# Altium schematic sheet USB-UART.SchDoc
size Letter; Organization: Cegep Limoilou; Address1: 1300, 8e Avenue; Address2: Québec, QC; Address3: Canada; Address4: G1J 5L5; Revision: Enseignants; SheetNumber: 8; SheetTotal: 8; Conception: Ilyes Gharmoul; Titre: USB-UART; Modification: Ilyes G
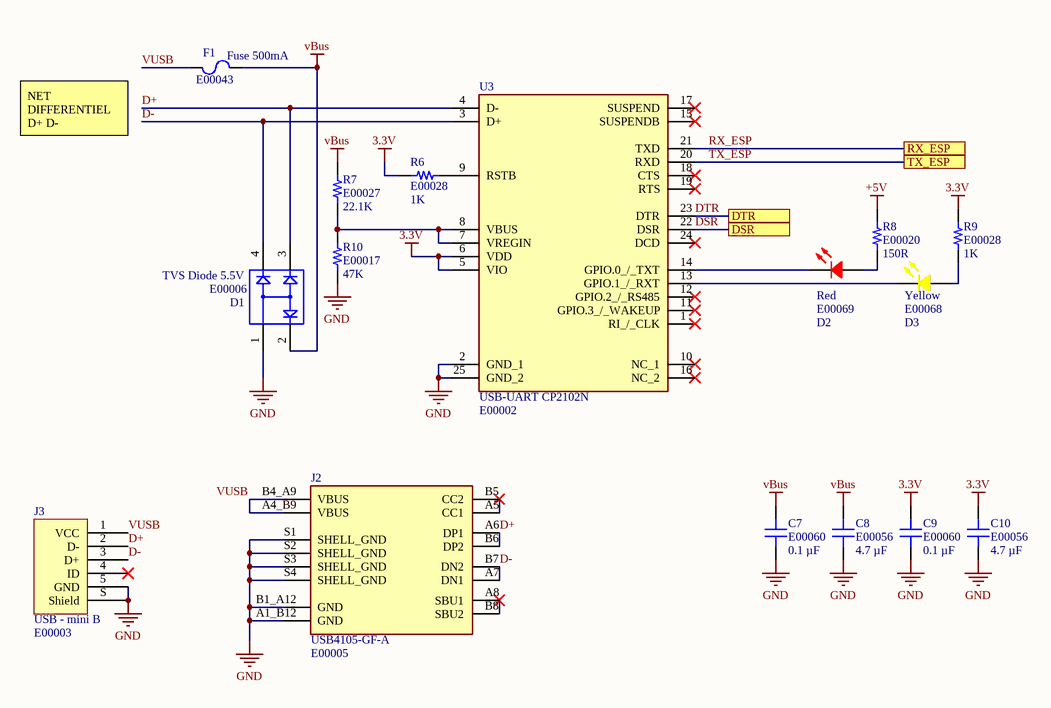
[diagram p0: USB-UART.SchDoc]

## Parts
C7  ADAM Inventory Number 1: E00060  [CAP 0603]  (hidden comment: 0.1 µF)
C8  ADAM Inventory Number 1: E00056  [CAP 0603]  (hidden comment: 4.7 µF)
C9  ADAM Inventory Number 1: E00060  [CAP 0603]  (hidden comment: 0.1 µF)
C10  ADAM Inventory Number 1: E00056  [CAP 0603]  (hidden comment: 4.7 µF)
D1  TVS Diode 5.5V  ADAM Inventory Number 1: E00006  [TVS 5.5 DIODE]
D2  Red  ADAM Inventory Number 1: E00069  [Red Led 0603]
D3  Yellow  ADAM Inventory Number 1: E00068  [YELLOW LED 0603 - duplicate]
F1  Fuse 500mA  ADAM Inventory Number 1: E00043  [Fuse 500mA 0.6mm]
J2  USB4105-GF-A  ADAM Inventory Number 1: E00005  [USB C HORIZONTAL]
J3  USB - mini B  ADAM Inventory Number 1: E00003  [USB B Horizontal]
R6  ADAM Inventory Number 1: E00028  [RES 0603]  (hidden comment: 1K)
R7  ADAM Inventory Number 1: E00027  [RES 0603]  (hidden comment: 22.1K)
R8  ADAM Inventory Number 1: E00020  [RES 0603]  (hidden comment: 150R)
R9  ADAM Inventory Number 1: E00028  [RES 0603]  (hidden comment: 1K)
R10  ADAM Inventory Number 1: E00017  [RES 0603]  (hidden comment: 47K)
U3  USB-UART CP2102N  ADAM Inventory Number 1: E00002  [CP2102N-USB-UART]

## Ports
DSR, DTR, RX_ESP, TX_ESP

## Nets
3.3V: C9.2 C10.2 R6.2 R9.2 U3.5(VIO) U3.6(VDD)
+5V: R8.2
GND: C7.1 C8.1 C9.1 C10.1 D1.1 J2.A1_B12(GND) J2.B1_A12(GND) J2.S1(SHELL_GND) J2.S2(SHELL_GND) J2.S3(SHELL_GND) J2.S4(SHELL_GND) J3.5(GND) J3.S(Shield) R10.1 U3.2(GND_1) U3.25(GND_2)
vBus: C7.2 C8.2 D1.2 F1.2 R7.2
D+: D1.3 J2.A6(DP1) J2.B6(DP2) J3.2(D-) U3.4(D-)
D-: D1.4 J2.A7(DN1) J2.B7(DN2) J3.3(D+) U3.3(D+)
DSR: U3.22(DSR) ; port DSR
DTR: U3.23(DTR) ; port DTR
RX_ESP: U3.21(TXD) ; port RX_ESP
TX_ESP: U3.20(RXD) ; port TX_ESP
VUSB: F1.1 J2.A4_B9(VBUS) J2.B4_A9(VBUS) J3.1(VCC)
NetD2_1: D2.1 R8.1
NetD2_2: D2.2 U3.14(GPIO.0_/_TXT)
NetD3_1: D3.1 R9.1
NetD3_2: D3.2 U3.13(GPIO.1_/_RXT)
NetJ2_A5: J2.A5(CC1) J2.B5(CC2)
NetJ2_A8: J2.A8(SBU1) J2.B8(SBU2)
NetR6_1: R6.1 U3.9(RSTB)
NetR7_1: R7.1 R10.2 U3.7(VREGIN) U3.8(VBUS)

Not connected (* = marked no-connect by the designer): J3 4(ID)*; U3 1(RI_/_CLK)* 10(NC_1)* 11(GPIO.3_/_WAKEUP)* 12(GPIO.2_/_RS485)* 15(SUSPENDB)* 16(NC_2)* 17(SUSPEND)* 18(CTS)* 19(RTS)* 24(DCD)*

## Notes on the sheet
- NET DIFFERENTIEL D+ D-
- Titre :
- Conception :
- Date :
- Modification :
- Heure :
- Révision :
- Feuille
- de
- Fichier :

## Library data of the parts
C7 C9 = CAP CER 0.1UF 50V X7R 0603: Manufacturer Part Number 1: C0603C104K5RAC7411; manufacturer: KEMET; Tolerance: ±10%; Applications: Bypass, Decoupling; Capacitance: 0.1 µF; componentlink1description: Datasheet; componentlink1url: https://api.kemet.com/component-edge/download/datasheet/C0603C104K5RAC7411.pdf; componentlink2description: DigiKey Link; componentlink2url: https://www.digikey.com/en/products/detail/kemet/C0603C104K5RAC7411/3317013; Device Package: 0603 (1608 Metric); lastupdated: 2023-03-28 19:09:05; Lifecycle Status: Active; Minimum Order: 1; Mounting Type: Surface Mount, MLCC; Operating Temperature: -55°C ~ 125°C; Package / Case: 0603 (1608 Metric); packaging: TapeAndReel; partid: 2233; Part Status: Active; price: 0.01; series: SMD Comm X7R; Size / Dimension: 0.063" L x 0.031" W (1.60mm x 0.80mm); Supplier 1: DigiKey; Supplier Part Number 1: 399-C0603C104K5RAC7411CT-ND; Temperature Coefficient: X7R; Thickness (Max): 0.035" (0.90mm); Voltage - Rated: 50V; Value: 0.1 µF
C8 C10 = CAP CER 4.7UF 25V X5R 0603: Manufacturer Part Number 1: CL10A475KA8NQNC; manufacturer: Samsung Electro-Mechanics; Tolerance: ±10%; Applications: General Purpose; Capacitance: 4.7 µF; componentlink1description: Datasheet; componentlink1url: http://www.samsungsem.com/kr/support/product-search/mlcc/CL10A475KA8NQNC.jsp; componentlink2description: DigiKey Link; componentlink2url: https://www.digikey.com/en/products/detail/samsung-electro-mechanics/CL10A475KA8NQNC/3887558; Device Package: 0603 (1608 Metric); lastupdated: 2023-03-30 19:09:15; Lifecycle Status: Active; Minimum Order: 1; Mounting Type: Surface Mount, MLCC; Operating Temperature: -55°C ~ 85°C; Package / Case: 0603 (1608 Metric); packaging: TapeAndReel; partid: 2349; Part Status: Active; price: 0.06; series: CL; Size / Dimension: 0.063" L x 0.031" W (1.60mm x 0.80mm); Supplier 1: DigiKey; Supplier Part Number 1: 1276-1900-1-ND; Temperature Coefficient: X5R; Thickness (Max): 0.035" (0.90mm); Voltage - Rated: 25V; Value: 4.7 µF
D1 = TVS Diode 5.5V: 8.5V Clamp Ipp Tvs Diode Surface Mount SOT-143-4; Manufacturer Part Number 1: SP0503BAHTG; Manufacturer: Littelfuse; Component Type: Diodes
D2 = 0603 RED LED: Manufacturer Part Number 1: BL-HUB36A-AV-TRB; Manufacturer: American Bright Optoelectronics Corporation; Configuration: Standard; Current - Test: 20mA; Lens Color: Colorless; Lens Style: Rectangle with Flat Top; Lens Transparency: Clear; Millicandela Rating: 94mcd; Viewing Angle: 120°; Voltage - Forward (Vf) (Typ): 2.2V; Wavelength - Dominant: 632nm; Wavelength - Peak: 645nm; Color: Red; ComponentLink1Description: Datasheet; ComponentLink1URL: https://americanbrightled.com/pdffiles/smt/BL-HUB36A-AV-TRB.pdf; ComponentLink2Description: DigiKey Link; ComponentLink2URL: https://www.digikey.com/en/products/detail/american-bright-optoelectronics-corporation/BL-HUB36A-AV-TRB/9678174; Device Package: 0603 (1608 Metric); Height (Max): 0.70mm; LastUpdated: 2023-03-27 19:53:19; Lifecycle Status: Active; Minimum Order: 1; Mounting Type: Surface Mount; Package / Case: 0603 (1608 Metric); Packaging: TapeAndReel; PartId: 1020; Part Status: Active; Price: 0.04; Series: -; Size / Dimension: 1.60mm L x 0.80mm W; Supplier 1: DigiKey; Supplier Part Number 1: BL-HUB36A-AV-TRBCT-ND; Supplier Device Package: 0603; Value: Red
D3 = 0603 YELLOW LED: 0603 YELLOW; Manufacturer Part Number 1: BL-HKC36D-AV-TRB; Manufacturer: American Bright Optoelectronics Corporation; Configuration: 0603; Current - Test: 20mA; Lens Color: Colorless; Lens Size: 0.87mm x 0.80mm; Lens Style: Rectangle with Flat Top; Lens Transparency: Clear; Millicandela Rating: 120mcd; Viewing Angle: 120°; Voltage - Forward (Vf) (Typ): 2V; Wavelength - Dominant: 589nm; Wavelength - Peak: 590nm; Color: Yellow; ComponentLink1Description: Datasheet; ComponentLink1URL: http://americanbrightled.com/pdffiles/smt/BL-HKC36D-AV-TRB.pdf; ComponentLink2Description: DigiKey Link; ComponentLink2URL: https://www.digikey.com/en/products/detail/american-bright-optoelectronics-corporation/BL-HKC36D-AV-TRB/9678175; Device Package: 0603 (1608 Metric); Height (Max): 0.85mm; LastUpdated: 2023-03-27 19:54:01; Lifecycle Status: Active; Minimum Order: 1; Mounting Type: Surface Mount; Package / Case: 0603 (1608 Metric); Packaging: TapeAndReel; PartId: 82; Part Status: Active; Price: 0.04; Series: -; Size / Dimension: 1.60mm L x 0.80mm W; Supplier 1: DigiKey; Supplier Part Number 1: BL-HKC36D-AV-TRBCT-ND; Supplier Device Package: 0603; Value: Yellow
F1 = Fuse 500mA: FUSE BOARD MNT 500MA 125VAC/VDC; Manufacturer: Schurter Inc.; Manufacturer Part Number 1: 3413.0113.22; Approval Agency: cURus; Breaking Capacity @ Rated Voltage: 50A; Fuse Type: Board Mount (Cartridge Style Excluded); Melting I²t: 0.02; Response Time: Fast Blow; Voltage Rating - AC: 125V; Approvals: cURus; ComponentLink1Description: Datasheet; ComponentLink1URL: http://www.schurterinc.com/bundles/snceschurter/epim/_ProdPool_/newDS/en/typ_USF_1206.pdf; ComponentLink2Description: DigiKey Link; ComponentLink2URL: http://digikey.com/product-detail/en/schurter-inc/3413.0113.22/486-1675-1-ND/2870075; Current Rating (Amps): 500mA; Device Package: 1206 (3216 Metric); LastUpdated: 2020-09-02 01:30:41; Lifecycle Status: Active; Minimum Order: 1; Mounting Type: Surface Mount; Operating Temperature: -55°C ~ 90°C; Package / Case: 1206 (3216 Metric); Packaging: TapeAndReel; Part Status: Active; Price: 0.24; Series: USF 1206; Size / Dimension: 0.126" L x 0.063" W x 0.024" H (3.20mm x 1.60mm x 0.60mm); Supplier 1: DigiKey; Supplier Part Number 1: 486-1675-1-ND; Voltage Rating - DC: 125V
J2 = USB C: USB-C (USB TYPE-C) USB 2.0 Receptacle Connector 24 (16+8 Dummy) Position Surface Mount, Right Angle; Through Hole; Manufacturer Part Number 1: USB4105-GF-A; Supplier 1: Newark; Supplier Part Number 1: 86AH2021
J3 = USB MINI B: CONN RCPT MINI USB B 5POS SMD RA; Manufacturer: Amphenol ICC (FCI); Manufacturer Part Number 1: 10033526-N3212LF; Current Rating (Amps): 1A per Contact; Gender: Receptacle; Mating Cycles: 5000; Number of Contacts: 5; Number of Ports: 1; Shielding: Shielded; Voltage - Rated: 30V; ComponentLink1Description: Datasheet; ComponentLink1URL: http://www.amphenol-icc.com/media/wysiwyg/files/drawing/10033526.pdf; ComponentLink2Description: DigiKey Link; ComponentLink2URL: //digikey.com/product-detail/en/amphenol-icc-fci/10033526-N3212LF/609-4700-2-ND/4292074; Connector Type: USB - mini B; Features: Board Guide, Solder Retention; LastUpdated: 2019-12-09 20:52:14; Lifecycle Status: 0; Minimum Order: 1; Mounting Feature: Horizontal; Mounting Type: Surface Mount, Right Angle; Operating Temperature: -25°C ~ 85°C; Packaging: TapeAndReel; Part Status: Active; Price: 0.39; Series: -; Supplier 1: DigiKey; Supplier Part Number 1: 609-4700-2-ND; Termination: Solder
R6 R9 = RES SMD 1K OHM: RES 1K OHM 1% 1/4W 0603; Manufacturer Part Number 1: SR0603FR-7T1KL; Manufacturer: Yageo; Power (Watts): 0.25W, 1/4W; Temperature Coefficient: ±100ppm/°C; ComponentLink1Description: Datasheet; ComponentLink1URL: http://www.yageo.com/documents/recent/PYu-SR_D_F%20tol_RoHS_L_4.pdf; ComponentLink2Description: DigiKey Link; ComponentLink2URL: https://www.digikey.com/en/products/detail/yageo/SR0603FR-7T1KL/9373103; Composition: Thick Film; Device Package: 0603 (1608 Metric); Features: Automotive AEC-Q200, Pulse Withstanding; Height - Seated (Max): 0.022" (0.55mm); LastUpdated: 2023-03-28 19:29:47; Lifecycle Status: Active; Minimum Order: 1; Number of Terminations: 2; Operating Temperature: -55°C ~ 155°C; Package / Case: 0603 (1608 Metric); Packaging: TapeAndReel; PartId: 10088; Part Status: Active; Price: 0.16; Ratings: AEC-Q200; Resistance: 1K; Series: SR; Size / Dimension: 0.063" L x 0.031" W (1.60mm x 0.80mm); Supplier 1: DigiKey; Supplier Part Number 1: YAG5829CT-ND; Supplier Device Package: 0603; Tolerance: ±1%; Value: 1K
R7 = RES SMD 22.1K OHM: RES 22.1K OHM 1% 1/10W 0603; Manufacturer Part Number 1: RMCF0603FT22K1; Manufacturer: Stackpole Electronics Inc; Power (Watts): 0.1W, 1/10W; Temperature Coefficient: ±100ppm/°C; ComponentLink1Description: Datasheet; ComponentLink1URL: https://www.seielect.com/catalog/sei-rmcf_rmcp.pdf; ComponentLink2Description: DigiKey Link; ComponentLink2URL: https://www.digikey.com/en/products/detail/stackpole-electronics-inc/RMCF0603FT22K1/1760764; Composition: Thick Film; Device Package: 0603 (1608 Metric); Features: Automotive AEC-Q200; Height - Seated (Max): 0.022" (0.55mm); LastUpdated: 2023-03-27 19:26:47; Lifecycle Status: Active; Minimum Order: 1; Number of Terminations: 2; Operating Temperature: -55°C ~ 155°C; Package / Case: 0603 (1608 Metric); Packaging: CutTape; PartId: 6076; Part Status: Active; Price: 0.01; Ratings: AEC-Q200; Resistance: 22.1K; Series: RMCF; Size / Dimension: 0.061" L x 0.031" W (1.55mm x 0.80mm); Supplier 1: DigiKey; Supplier Part Number 1: RMCF0603FT22K1CT-ND; Supplier Device Package: 0603; Tolerance: ±1%; Value: 22.1K
R8 = RES SMD 150 OHM: RES SMD 150 OHM 0.1% 1/8W 0603; Manufacturer Part Number 1: RC0603FR-07150RL; Manufacturer: Vishay Beyschlag; Power (Watts): 0.125W, 1/8W; Temperature Coefficient: ±25ppm/°C; ComponentLink1Description: Datasheet; ComponentLink1URL: http://www.vishay.com/docs/28785/mcat_pre.pdf; ComponentLink2Description: DigiKey Link; ComponentLink2URL: http://digikey.com/product-detail/en/vishay-beyschlag/MCT0603MD1500BP100/MCT0603-150-MBCT-ND/2092134; Composition: Thin Film; Device Package: 0603 (1608 Metric); Features: Anti-Sulfur, Automotive AEC-Q200; Height - Seated (Max): 0.022" (0.55mm); LastUpdated: 2023-04-04 19:29:46; Lifecycle Status: Active; Minimum Order: 1; Number of Terminations: 2; Operating Temperature: -55°C ~ 155°C; Package / Case: 0603 (1608 Metric); Packaging: TapeAndReel; PartId: 5246; Part Status: Active; Price: 0.23; Ratings: AEC-Q200; Resistance: 150R; Series: MCT AT - Precision; Size / Dimension: 0.061" L x 0.033" W (1.55mm x 0.85mm); Supplier Device Package: 0603; Tolerance: ±0.1%; Supplier 1: Future Electronics; Supplier Part Number 1: 1201284; Value: 150R
R10 = RES SMD 47K OHM: RES SMD 47K OHM 5% 1/4W 0603; Manufacturer Part Number 1: AC0603FR-0747KL; Manufacturer: Vishay Dale; Power (Watts): 0.25W, 1/4W; Temperature Coefficient: ±200ppm/°C; ComponentLink1Description: Datasheet; ComponentLink1URL: http://www.vishay.com/docs/20065/rcse3.pdf; ComponentLink2Description: DigiKey Link; ComponentLink2URL: https://www.digikey.com/en/products/detail/vishay-dale/RCS060347K0JNEA/5866965; Composition: Thick Film; Device Package: 0603 (1608 Metric); Features: Automotive AEC-Q200, Pulse Withstanding; Height - Seated (Max): 0.020" (0.50mm); LastUpdated: 2023-03-27 19:26:49; Lifecycle Status: Active; Minimum Order: 1; Number of Terminations: 2; Operating Temperature: -55°C ~ 155°C; Package / Case: 0603 (1608 Metric); Packaging: TapeAndReel; PartId: 5445; Part Status: Active; Price: 0.02; Ratings: AEC-Q200; Resistance: 47K; Series: RCS e3; Size / Dimension: 0.061" L x 0.033" W (1.55mm x 0.85mm); Supplier Device Package: 0603; Tolerance: ±5%; Supplier 1: Future Electronics; Supplier Part Number 1: 8029293; Value: 47K
U3 = USB-UART CP2102N: USB Interface IC USBXpress - USB to UART Bridge QFN24; Manufacturer Part Number 1: CP2102N-A02-GQFN24; Manufacturer: Silicon Labs; Component Type: Interface